# EAGLE design Adafruit Cupcade (EAGLE 6.6.0)
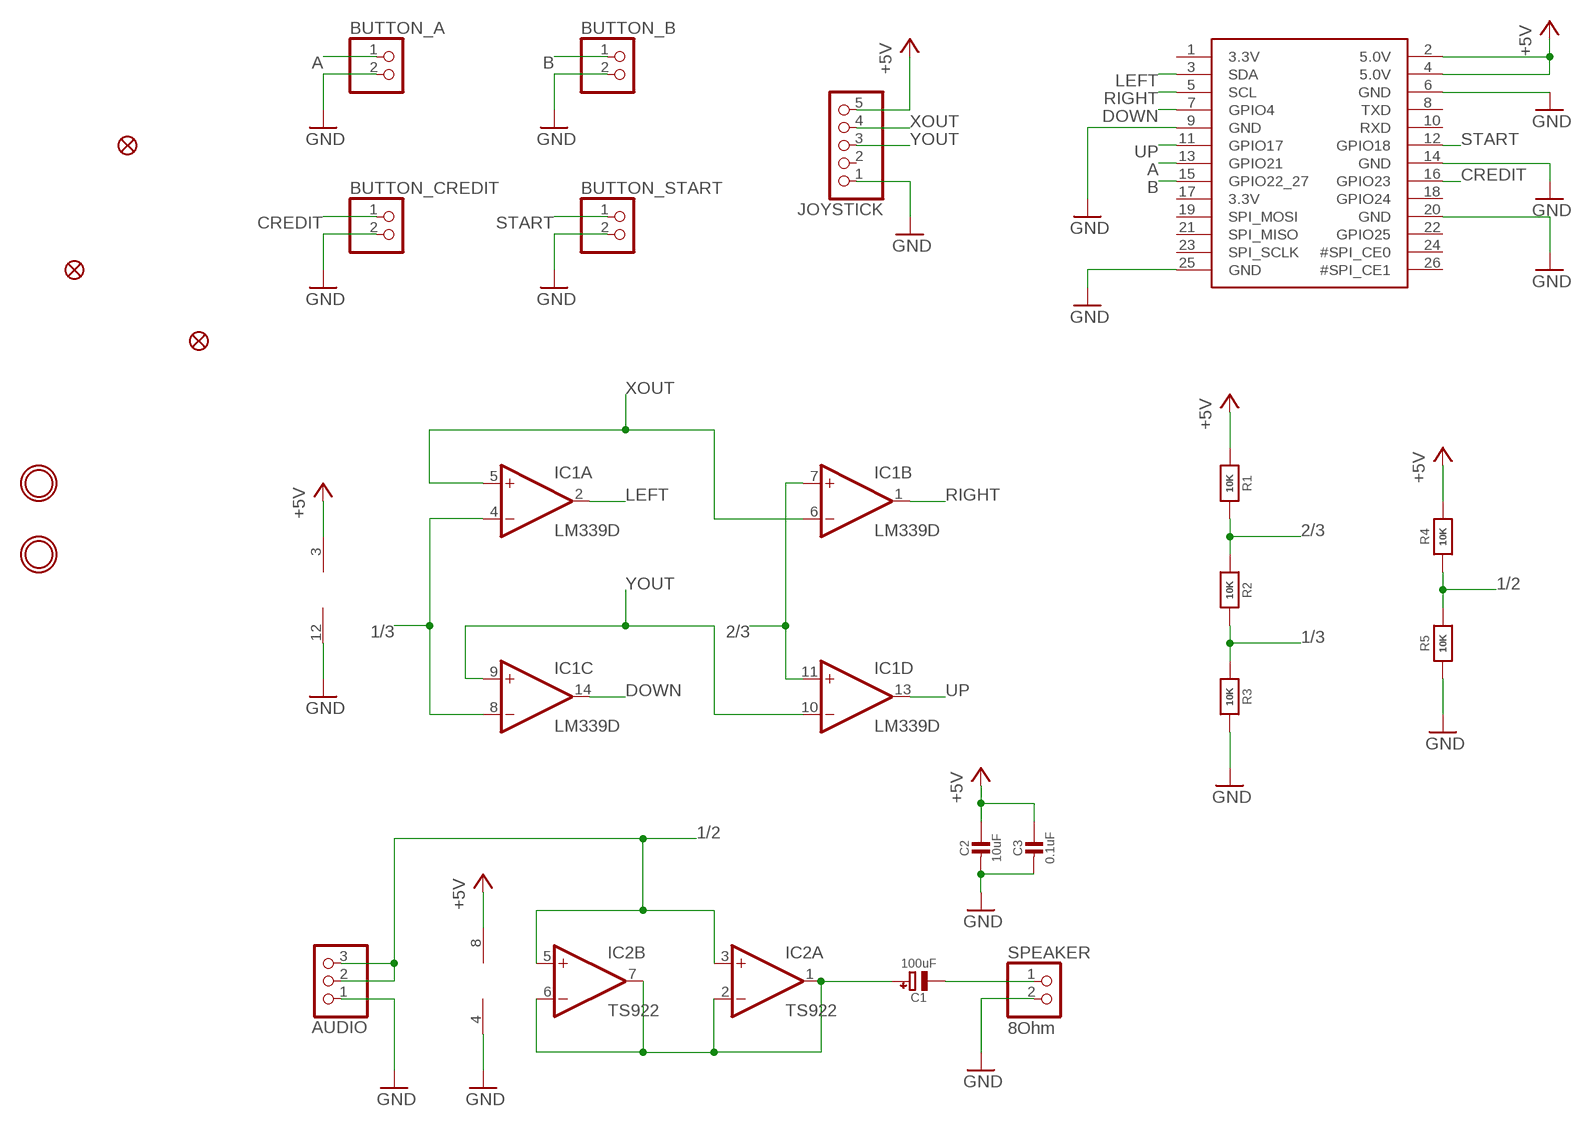
[diagram p0: schematic, sheet 1]

## Parts
AUDIO  HEADER-1X3  [1X03_OVAL]
BUTTON_A  HEADER-1X2  [1X02_OVAL]
BUTTON_B  HEADER-1X2  [1X02_OVAL]
BUTTON_CREDIT  HEADER-1X2  [1X02_OVAL]
BUTTON_START  HEADER-1X2  [1X02_OVAL]
C1  100uF  CAP_ELECTROLYTICPANASONIC_C  [PANASONIC_C]
C2  10uF  CAP_CERAMIC0805-NOOUTLINE  [0805-NO]
C3  0.1uF  CAP_CERAMIC0805-NOOUTLINE  [0805-NO]
FID1  FIDUCIAL""  [FIDUCIAL_1MM]
FID2  FIDUCIAL""  [FIDUCIAL_1MM]
FID3  FIDUCIAL""  [FIDUCIAL_1MM]
IC1  LM339D  [SO14]
IC2  TS922  TL072D  [SO08]
JOYSTICK  HEADER-1X5  [1X05_OVAL]
JP1  RASBERRYPI_IDC  [RASBERRYPI_IDC]
R1  10K  RESISTOR0805_NOOUTLINE  [0805-NO]
R2  10K  RESISTOR0805_NOOUTLINE  [0805-NO]
R3  10K  RESISTOR0805_NOOUTLINE  [0805-NO]
R4  10K  RESISTOR0805_NOOUTLINE  [0805-NO]
R5  10K  RESISTOR0805_NOOUTLINE  [0805-NO]
SPEAKER  8Ohm  HEADER-1X2  [1X02_OVAL]
U$2  MOUNTINGHOLE2.5  [MOUNTINGHOLE_2.5_PLATED]
U$3  MOUNTINGHOLE2.5  [MOUNTINGHOLE_2.5_PLATED]

## Nets
1/2: AUDIO.2 AUDIO.3 IC2.3(A:+IN) IC2.5(B:+IN) R4.1 R5.2
1/3: IC1.4(A:-IN) IC1.8(C:-IN) R2.2 R3.1
2/3: IC1.7(B:+IN) IC1.11(D:+IN) R1.2 R2.1
+5V: C2.1 C3.1 IC1.3(P:V+) IC2.8(P:V+) JOYSTICK.5 JP1.2(5.0V) JP1.4(5.0V) R1.1 R4.2
A: BUTTON_A.1 JP1.13(GPIO21)
B: BUTTON_B.1 JP1.15(GPIO22_27)
CREDIT: BUTTON_CREDIT.1 JP1.16(GPIO23)
DOWN: IC1.14(C:OUT) JP1.7(GPIO4)
GND: AUDIO.1 BUTTON_A.2 BUTTON_B.2 BUTTON_CREDIT.2 BUTTON_START.2 C2.2 C3.2 IC1.12(P:GND) IC2.4(P:V-) JOYSTICK.1 JP1.6(GND) JP1.9(GND) JP1.14(GND) JP1.20(GND) JP1.25(GND) R3.2 R5.1 SPEAKER.2
LEFT: IC1.2(A:OUT) JP1.3(SDA)
N$3: C1.- SPEAKER.1
N$5: C1.+ IC2.1(A:OUT) IC2.2(A:-IN) IC2.6(B:-IN) IC2.7(B:OUT)
RIGHT: IC1.1(B:OUT) JP1.5(SCL)
START: BUTTON_START.1 JP1.12(GPIO18)
UP: IC1.13(D:OUT) JP1.11(GPIO17)
XOUT: IC1.5(A:+IN) IC1.6(B:-IN) JOYSTICK.4
YOUT: IC1.9(C:+IN) IC1.10(D:-IN) JOYSTICK.3
Unconnected: JOYSTICK.2 JP1.1(3.3V) JP1.8(TXD) JP1.10(RXD) JP1.17(3.3V) JP1.18(GPIO24) JP1.19(SPI_MOSI) JP1.21(SPI_MISO) JP1.22(GPIO25) JP1.23(SPI_SCLK) JP1.24(#SPI_CE0) JP1.26(#SPI_CE1)

## Library data of the parts
AUDIO = microbuilder:HEADER-1X3: PIN HEADER
BUTTON_A BUTTON_B BUTTON_CREDIT BUTTON_START SPEAKER = microbuilder:HEADER-1X2: PIN HEADER
C1 = microbuilder:CAP_ELECTROLYTIC: Electrolytic Capacitors SMT PANASONIC_C - Size C Panasonic Electrolytic Aluminum Capacitor 47µF 16V 20% Electrolytic Capacitor [Digikey: PCE3890TR-ND] PANASONIC_D - Size D Panasonic Electrolytic Aluminum Capacitor 100µF 25V 20% Electrolytic Capacitor [Digikey: PCE3898TR-ND] PTH 3.5 mm grid, 8 mm diameter ... 3.5 mm grid, 10 mm diameter ...
C2 C3 = microbuilder:CAP_CERAMIC: Ceramic Capacitors For new designs, use the packages preceded by an '_' character since they are more reliable: The following footprints should be used on most boards: _0402 - Standard footprint for regular board layouts _0603 - Standard footprint for regular board layouts _0805 - Standard footprint for regular board layouts _1206 - Standard footprint for regular board layouts For extremely tight-pitch boards where space is at a premium, the following 'micro-pitch' footprints can be used (smaller pads, no silkscreen outline, etc.): _0402MP - Micro-pitch footprint for very dense/compact boards _0603MP - Micro-pitch footprint for very dense/compact boards _0805MP - Micro-pitch footprint for very dense/compact boards _1206MP - Micro-pitch footprint for very dense/compact boards
FID1-FID3 = microbuilder:FIDUCIAL: Fiducial Alignment Points Various fiducial points for machine vision alignment.; BOM: EXCLUDE
IC1 = linear:LM339: Low Power Low Offset Voltage Quad Comparators with open collector; LM139/LM239/LM339/LM2901/LM3302
IC2 = linear:TL072: OP AMP
JOYSTICK = microbuilder:HEADER-1X5: PIN HEADER
JP1 = microbuilder:RASBERRYPI_IDC: Rasberry PI IDC Header
R1-R5 = microbuilder:RESISTOR: Resistors For new designs, use the packages preceded by an '_' character since they are more reliable: The following footprints should be used on most boards: _0402 - Standard footprint for regular board layouts _0603 - Standard footprint for regular board layouts _0805 - Standard footprint for regular board layouts _1206 - Standard footprint for regular board layouts For extremely tight-pitch boards where space is at a premium, the following 'micro-pitch' footprints can be used (smaller pads, no silkscreen outline, etc.): _0402MP - Micro-pitch footprint for very dense/compact boards _0603MP - Micro-pitch footprint for very dense/compact boards _0805MP - Micro-pitch footprint for very dense/compact boards _1206MP - Micro-pitch footprint for very dense/compact boards
U$2 U$3 = microbuilder:MOUNTINGHOLE: Mounting Hole For #2 screws (0.086"/2.18mm width, 0.094"/2.4mm hole) use 2.5mm; BOM: EXCLUDE

## Board
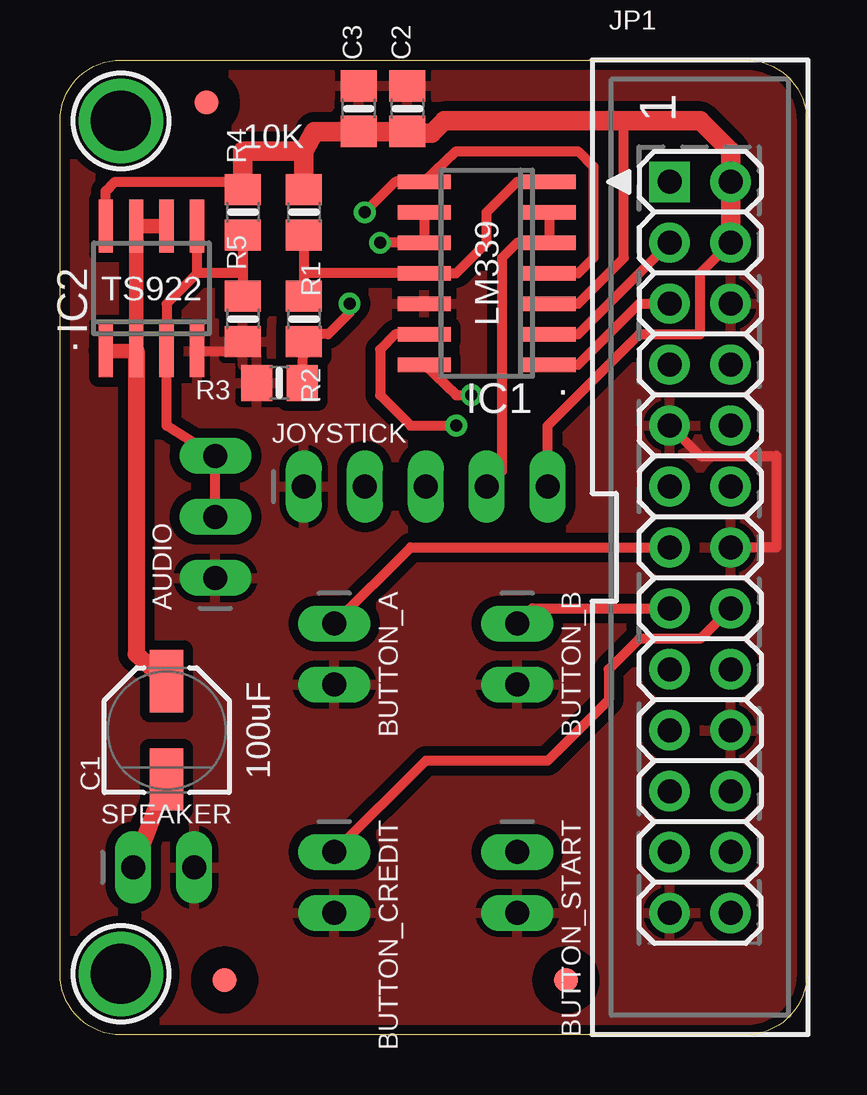
[diagram p1: board, top side]
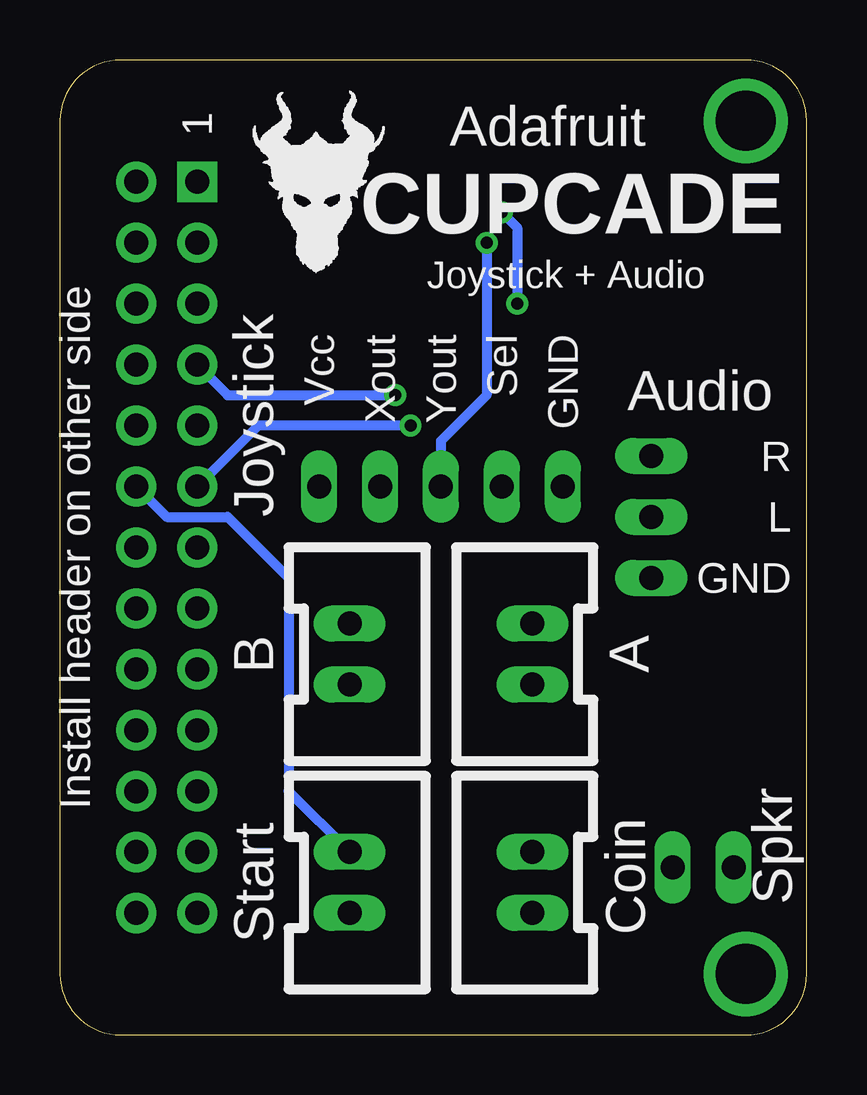
[diagram p2: board, bottom side, seen from below]

Size 31.11 x 40.64 mm. Coordinates in mm from the lower left corner, seen from the top.
Outline: 28.57,0 2.54,0 arc-90 0,2.54 0,38.1 arc-90 2.54,40.64 28.57,40.64 arc-90 31.11,38.1 31.11,2.54 arc-90 28.57,0
Copper layers (1*16): Top 0.035mm / dielectric 1.5mm / Bottom 0.035mm
Design rules "adafruit": minimum track width 8mil, minimum drill 15.5mil, track to track 8mil, track to pad 8mil, pad to pad 8mil, via to via 8mil, smd to smd 8mil, copper to edge 10mil, drill to drill 8mil, minimum pad ring 10mil, minimum via ring 8mil, stop-mask expansion 2mil, vias tented up to drill 20mil, thermal gap 10mil

### Footprints (pad centres in the part's own frame; a part is rotated, then mirrored left to right if it is on the bottom)
1X03_OVAL = drill 1 long: 1 -2.54,0; 2 0,0; 3 2.54,0
1X02_OVAL = drill 1 long: 1 -1.27,0; 2 1.27,0
PANASONIC_C = smd 2.6 x 1.4: + 2.05,0; - -2.05,0
0805-NO = smd 1.3 x 1.5: 1 -0.95,0; 2 0.95,0
FIDUCIAL_1MM = smd 1 x 1: 1 0,0
SO14 = smd 0.6 x 2.2: 1 -3.81,-2.6; 2 -2.54,-2.6; 3 -1.27,-2.6; 4 0,-2.6; 5 1.27,-2.6; 6 2.54,-2.6; 7 3.81,-2.6; 8 3.81,2.6; 9 2.54,2.6; 10 1.27,2.6; 11 0,2.6; 12 -1.27,2.6; 13 -2.54,2.6; 14 -3.81,2.6
SO08 = smd 0.6 x 2.2: 1 -1.905,-2.6; 2 -0.635,-2.6; 3 0.635,-2.6; 4 1.905,-2.6; 5 1.905,2.6; 6 0.635,2.6; 7 -0.635,2.6; 8 -1.905,2.6
1X05_OVAL = drill 1 long: 1 -5.08,0; 2 -2.54,0; 3 0,0; 4 2.54,0; 5 5.08,0
RASBERRYPI_IDC = drill 1 pad 1.676 square: 1 -1.27,15.24 | drill 1 pad 1.676: 2 1.27,15.24; 3 -1.27,12.7; 4 1.27,12.7; 5 -1.27,10.16; 6 1.27,10.16; 7 -1.27,7.62; 8 1.27,7.62; 9 -1.27,5.08; 10 1.27,5.08; 11 -1.27,2.54; 12 1.27,2.54; 13 -1.27,0; 14 1.27,0; 15 -1.27,-2.54; 16 1.27,-2.54; 17 -1.27,-5.08; 18 1.27,-5.08; 19 -1.27,-7.62; 20 1.27,-7.62; 21 -1.27,-10.16; 22 1.27,-10.16; 23 -1.27,-12.7; 24 1.27,-12.7; 25 -1.27,-15.24; 26 1.27,-15.24
MOUNTINGHOLE_2.5_PLATED = drill 2.5 pad 3.2: P$1 0,0

### Placement (x,y rotation side)
AUDIO  6.48,21.59 90 top
BUTTON_A  11.43,15.88 270 top
BUTTON_B  19.05,15.88 270 top
BUTTON_CREDIT  11.43,6.35 270 top
BUTTON_START  19.05,6.35 270 top
C1  4.45,12.7 90 top
C2  14.48,38.61 90 top
C3  12.45,38.61 90 top
FID1  6.86,2.29 0 top
FID2  21.08,2.29 0 top
FID3  6.1,38.86 0 top
IC1  17.78,31.75 90 top
IC2  3.81,31.11 0 top
JOYSTICK  15.24,22.86 0 top
JP1  26.67,20.32 0 top
R1  10.16,34.29 270 top
R2  10.16,29.84 270 top
R3  9.14,27.18 180 top
R4  7.62,34.29 90 top
R5  7.62,29.84 90 top
SPEAKER  4.32,6.99 0 top
U$1  [DRAGON_300MIL]  23.11,31.75 0 bottom
U$2  2.54,2.54 0 top
U$3  2.54,38.1 0 top

### Tracks (layer width: path | path; a pad name or v marks a point on that pad's centre or on a via)
1/2
  Top 0.406: AUDIO.2 AUDIO.3 4.45,25.4 IC2.3 4.45,30.48 5.71,31.75 | 5.71,31.75 IC2.5 | R4.1 7.62,31.75 | 7.62,31.75 R5.2 | 7.62,31.75 5.71,31.75
1/3  (via drill 0.5)
  Top 0.406: IC1.4 21.59,31.75 22.23,32.38 22.23,36.2 21.59,36.83 16.51,36.83 IC1.8 13.97,35.56 v12.7,34.29 | R3.1 10.16,29.21 | 10.16,29.21 R2.2 | v12.06,30.48 12.06,30.1 11.18,29.21 10.16,29.21
  Bottom 0.406: v12.7,34.29 12.06,33.66 v12.06,30.48
2/3
  Top 0.406: IC1.7 19.05,35.56 17.78,34.29 17.78,33.02 16.51,31.75 IC1.11 10.16,31.75 | R1.2 10.16,31.75 | 10.16,31.75 R2.1
+5V
  Top 0.406: IC1.3 21.59,30.48 23.5,32.38 23.5,38.1 | JOYSTICK.5 20.32,25.4 24.13,29.21 26.67,29.21 26.67,31.75 JP1.4 | IC2.8 1.91,35.18 2.29,35.56 7.3,35.56 R4.2
  Top 0.813: JP1.4 JP1.2 27.94,36.83 26.67,38.1 23.5,38.1 16,38.1 15.49,37.59 14.54,37.59 C2.1 C3.1 10.6,37.66 10.16,36.83 | 10.16,36.83 7.62,36.83 R4.2 | R1.1 10.16,36.83
A
  Top 0.406: BUTTON_A.1 14.61,20.32 JP1.13
B
  Top 0.406: BUTTON_B.1 19.68,17.78 JP1.15
CREDIT
  Top 0.406: JP1.16 26.67,16.51 24.13,16.51 22.86,15.24 22.86,13.97 20.32,11.43 15.24,11.43 BUTTON_CREDIT.1
DOWN  (via drill 0.5)
  Top 0.406: IC1.14 16.51,26.67 v17.14,26.67
  Bottom 0.406: JP1.7 24.13,26.67 v17.14,26.67
GND
  Top 0.406: JP1.9 26.67,24.13 29.84,24.13 29.84,20.32 JP1.14 | IC2.4 7.62,28.52 R5.1
  pour Top (isolate 0.406): 31.75,-0.64 -0.64,-0.64 -0.64,41.27 31.75,41.27
LEFT
  Top 0.406: IC1.2 21.59,29.21 JP1.3
N$3
  Top 0.711: C1.- SPEAKER.1
N$5
  Top 0.61: IC2.6 IC2.7 IC2.2 IC2.1
  Top 0.711: IC2.2 3.17,15.88 C1.+
RIGHT
  Top 0.406: IC1.1 21.59,27.94 24.13,30.48 JP1.5
START
  Bottom 0.406: JP1.12 26.67,21.59 24.13,21.59 21.59,19.05 21.59,10.16 BUTTON_START.1
UP  (via drill 0.5)
  Top 0.406: IC1.13 13.97,29.21 13.34,28.57 13.34,26.67 14.61,25.4 v16.51,25.4
  Bottom 0.406: v16.51,25.4 22.86,25.4 JP1.11
XOUT
  Top 0.406: IC1.6 IC1.5 19.05,33.02 18.41,32.38 18.41,23.5 JOYSTICK.4
YOUT  (via drill 0.5)
  Top 0.406: IC1.9 IC1.10 v13.34,33.02
  Bottom 0.406: v13.34,33.02 13.34,26.67 15.24,24.77 JOYSTICK.3

### Text on the board
tPlace: 10K | LM339 | TS922 | . | . | 100uF
bPlace: Adafruit | 1 | CUPCADE | Joystick + Audio | Vcc / Xout / Yout / Sel / GND | Audio | R / L / GND | Joystick | Install header on other side | A | B | Spkr | Coin | Start